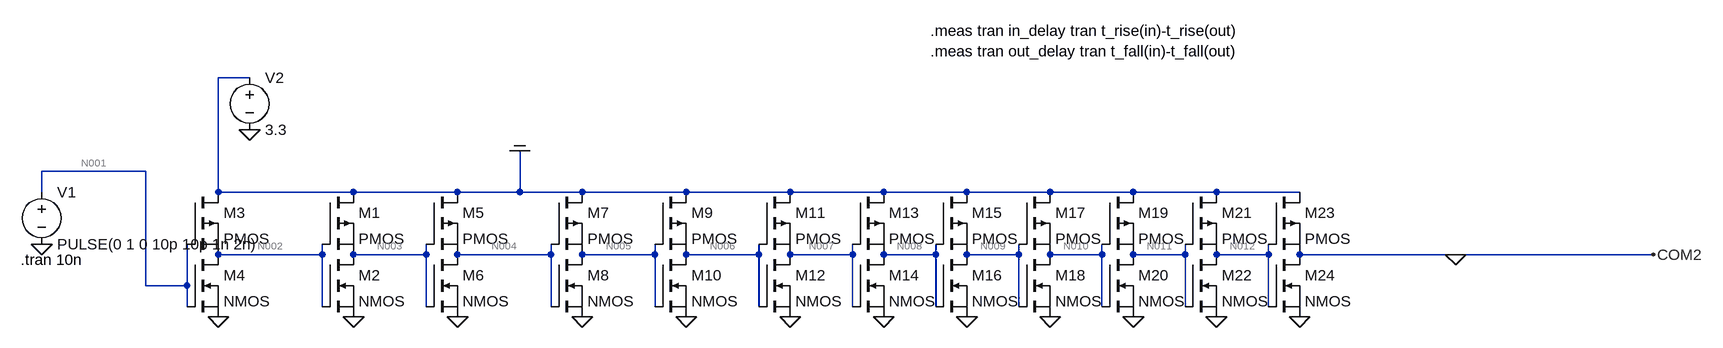
[diagram p0: schematic RingOscillator (2).asc]
RingOscillator (2).asc, the LTspice schematic file:
Version 4
SHEET 1 2484 680
WIRE 240 -112 192 -112
WIRE 80 32 -80 32
WIRE -80 64 -80 32
WIRE 192 64 192 -112
WIRE 400 64 192 64
WIRE 560 64 400 64
WIRE 656 64 656 0
WIRE 656 64 560 64
WIRE 752 64 656 64
WIRE 912 64 752 64
WIRE 1072 64 912 64
WIRE 1216 64 1072 64
WIRE 1344 64 1216 64
WIRE 1472 64 1344 64
WIRE 1600 64 1472 64
WIRE 1728 64 1600 64
WIRE 1856 64 1728 64
WIRE 352 160 352 144
WIRE 352 160 192 160
WIRE 512 160 512 144
WIRE 512 160 400 160
WIRE 704 160 704 144
WIRE 704 160 560 160
WIRE 864 160 864 144
WIRE 864 160 752 160
WIRE 1024 160 1024 144
WIRE 1024 160 912 160
WIRE 1168 160 1168 144
WIRE 1168 160 1072 160
WIRE 1296 160 1296 144
WIRE 1296 160 1216 160
WIRE 1424 160 1424 144
WIRE 1424 160 1344 160
WIRE 1552 160 1552 144
WIRE 1552 160 1472 160
WIRE 1680 160 1680 144
WIRE 1680 160 1600 160
WIRE 1808 160 1808 144
WIRE 1808 160 1728 160
WIRE 2096 160 1856 160
WIRE 2400 160 2096 160
WIRE 80 208 80 32
WIRE 144 208 144 144
WIRE 144 208 80 208
WIRE 144 240 144 208
WIRE 352 240 352 160
WIRE 512 240 512 160
WIRE 704 240 704 160
WIRE 864 240 864 160
WIRE 1024 240 1024 160
WIRE 1168 240 1168 160
WIRE 1296 240 1296 160
WIRE 1424 240 1424 160
WIRE 1552 240 1552 160
WIRE 1680 240 1680 160
WIRE 1808 240 1808 160
FLAG -80 144 0
FLAG 656 0 COM
IOPIN 656 0 Out
FLAG 400 256 0
FLAG 192 256 0
FLAG 240 -32 0
FLAG 560 256 0
FLAG 752 256 0
FLAG 912 256 0
FLAG 1072 256 0
FLAG 2400 160 COM2
FLAG 1216 256 0
FLAG 1344 256 0
FLAG 1472 256 0
FLAG 1600 256 0
FLAG 1728 256 0
FLAG 1856 256 0
FLAG 2096 160 0
SYMBOL pmos 352 64 R0
SYMATTR InstName M1
SYMBOL nmos 352 160 R0
SYMATTR InstName M2
SYMBOL voltage -80 48 R0
WINDOW 123 0 0 Left 0
WINDOW 39 0 0 Left 0
SYMATTR InstName V1
SYMATTR Value PULSE(0 1 0 10p 10p 1n 2n)
SYMBOL pmos 144 64 R0
SYMATTR InstName M3
SYMBOL nmos 144 160 R0
SYMATTR InstName M4
SYMBOL voltage 240 -128 R0
WINDOW 123 0 0 Left 0
WINDOW 39 0 0 Left 0
SYMATTR InstName V2
SYMATTR Value 3.3
SYMBOL pmos 512 64 R0
SYMATTR InstName M5
SYMBOL nmos 512 160 R0
SYMATTR InstName M6
SYMBOL pmos 704 64 R0
SYMATTR InstName M7
SYMBOL nmos 704 160 R0
SYMATTR InstName M8
SYMBOL pmos 864 64 R0
SYMATTR InstName M9
SYMBOL nmos 864 160 R0
SYMATTR InstName M10
SYMBOL pmos 1024 64 R0
SYMATTR InstName M11
SYMBOL nmos 1024 160 R0
SYMATTR InstName M12
SYMBOL pmos 1168 64 R0
SYMATTR InstName M13
SYMBOL nmos 1168 160 R0
SYMATTR InstName M14
SYMBOL pmos 1296 64 R0
SYMATTR InstName M15
SYMBOL nmos 1296 160 R0
SYMATTR InstName M16
SYMBOL pmos 1424 64 R0
SYMATTR InstName M17
SYMBOL nmos 1424 160 R0
SYMATTR InstName M18
SYMBOL pmos 1552 64 R0
SYMATTR InstName M19
SYMBOL nmos 1552 160 R0
SYMATTR InstName M20
SYMBOL pmos 1680 64 R0
SYMATTR InstName M21
SYMBOL nmos 1680 160 R0
SYMATTR InstName M22
SYMBOL pmos 1808 64 R0
SYMATTR InstName M23
SYMBOL nmos 1808 160 R0
SYMATTR InstName M24
TEXT -112 168 Left 2 !.tran 10n
TEXT 1288 -184 Left 2 !.meas tran in_delay tran t_rise(in)-t_rise(out)\n.meas tran out_delay tran t_fall(in)-t_fall(out)

The netlist it stands for:
* RingOscillator (2).asc
M1 COM N002 N003 N003 PMOS
M2 N003 N002 0 0 NMOS
V1 N001 0 PULSE(0 1 0 10p 10p 1n 2n)
M3 COM N001 N002 N002 PMOS
M4 N002 N001 0 0 NMOS
V2 COM 0 3.3
M5 COM N003 N004 N004 PMOS
M6 N004 N003 0 0 NMOS
M7 COM N004 N005 N005 PMOS
M8 N005 N004 0 0 NMOS
M9 COM N005 N006 N006 PMOS
M10 N006 N005 0 0 NMOS
M11 COM N006 N007 N007 PMOS
M12 N007 N006 0 0 NMOS
M13 COM N007 N008 N008 PMOS
M14 N008 N007 0 0 NMOS
M15 COM N008 N009 N009 PMOS
M16 N009 N008 0 0 NMOS
M17 COM N009 N010 N010 PMOS
M18 N010 N009 0 0 NMOS
M19 COM N010 N011 N011 PMOS
M20 N011 N010 0 0 NMOS
M21 COM N011 N012 N012 PMOS
M22 N012 N011 0 0 NMOS
M23 COM N012 0 0 PMOS
M24 0 N012 0 0 NMOS
.model NMOS NMOS
.model PMOS PMOS
.lib standard.mos
.tran 10n
.meas tran in_delay tran t_rise(in)-t_rise(out)
.meas tran out_delay tran t_fall(in)-t_fall(out)
.backanno
.end

* Results of the author's LTspice run, read from the files saved beside the schematic
* Operating Point, zero values left out:
*   V(com) = 3.3 V
*   V(n002) = 3.3 V
*   V(n003) = 2.703 V
*   V(n004) = 2.714 V
*   V(n005) = 2.714 V
*   V(n006) = 2.714 V
*   V(n007) = 2.714 V
*   V(n008) = 2.714 V
*   V(n009) = 2.714 V
*   V(n010) = 2.714 V
*   V(n011) = 2.714 V
*   V(n012) = 2.714 V
*   Id(M1) = 105.3 µA
*   Ib(M1) = -105.3 µA
*   Id(M3) = 6.61 pA
*   Is(M3) = -6.61 pA
*   Id(M5) = 73.07 µA
*   Ib(M5) = -69.51 µA
*   Is(M5) = -3.562 µA
*   Id(M7) = 73.65 µA
*   Ib(M7) = -70.21 µA
*   Is(M7) = -3.436 µA
*   Id(M9) = 73.64 µA
*   Ib(M9) = -70.2 µA
*   Is(M9) = -3.439 µA
*   Id(M11) = 73.64 µA
*   Ib(M11) = -70.2 µA
*   Is(M11) = -3.439 µA
*   Id(M13) = 73.64 µA
*   Ib(M13) = -70.2 µA
*   Is(M13) = -3.439 µA
*   Id(M15) = 73.64 µA
*   Ib(M15) = -70.2 µA
*   Is(M15) = -3.439 µA
*   Id(M17) = 73.64 µA
*   Ib(M17) = -70.2 µA
*   Is(M17) = -3.439 µA
*   Id(M19) = 73.64 µA
*   Ib(M19) = -70.2 µA
*   Is(M19) = -3.439 µA
*   Id(M21) = 73.64 µA
*   Ib(M21) = -70.2 µA
*   Is(M21) = -3.439 µA
*   Id(M23) = 1.872 TA
*   Ib(M23) = -1.872 TA
*   Id(M2) = 105.3 µA
*   Ib(M2) = -2.713 pA
*   Is(M2) = -105.3 µA
*   Id(M4) = 6.61 pA
*   Ib(M4) = -3.31 pA
*   Is(M4) = -3.3 pA
*   Id(M6) = 73.07 µA
*   Ib(M6) = -2.724 pA
*   Is(M6) = -73.07 µA
*   Id(M8) = 73.65 µA
*   Ib(M8) = -2.724 pA
*   Is(M8) = -73.65 µA
*   Id(M10) = 73.64 µA
*   Ib(M10) = -2.724 pA
*   Is(M10) = -73.64 µA
*   Id(M12) = 73.64 µA
*   Ib(M12) = -2.724 pA
*   Is(M12) = -73.64 µA
*   Id(M14) = 73.64 µA
*   Ib(M14) = -2.724 pA
*   Is(M14) = -73.64 µA
*   Id(M16) = 73.64 µA
*   Ib(M16) = -2.724 pA
*   Is(M16) = -73.64 µA
*   Id(M18) = 73.64 µA
*   Ib(M18) = -2.724 pA
*   Is(M18) = -73.64 µA
*   Id(M20) = 73.64 µA
*   Ib(M20) = -2.724 pA
*   Is(M20) = -73.64 µA
*   Id(M22) = 73.64 µA
*   Ib(M22) = -2.724 pA
*   Is(M22) = -73.64 µA
*   I(V2) = -1.872 TA
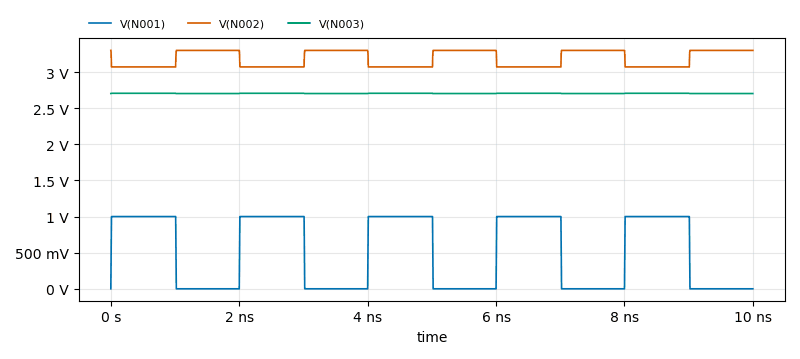
[diagram p1: Transient Analysis of RingOscillator (2).asc, plotted from the saved traces]
* Transient Analysis, 1 run:
*   V(N001): min 0 V, max 1 V, average 505 mV, rms 709.5 mV, last 0 V
*   V(N002): min 3.071 V, max 3.301 V, average 3.185 V, rms 3.187 V, last 3.3 V
*   V(N003): min 2.703 V, max 2.706 V, average 2.705 V, rms 2.705 V, last 2.703 V
* From the log:
*   in_delay=1e-08 FROM 0 TO 1e-08
*   out_delay=1e-08 FROM 0 TO 1e-08